# Altium schematic sheet MCU.SchDoc
size A4; CompanyName: TechOcean Sp. z o. o.; Address1: 02-639 Warszawa; Address2: Domaniewska 37A/119; Revision: 1.0; SheetNumber: 2; SheetTotal: 5
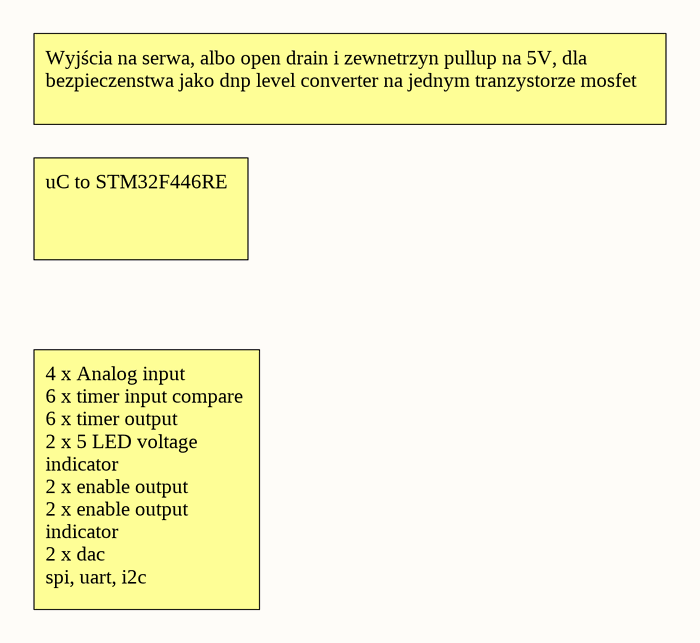
[diagram p0: MCU.SchDoc]

## Notes on the sheet
- Wyjścia na serwa, albo open drain i zewnetrzyn pullup na 5V, dla bezpieczenstwa jako dnp level converter na jednym tranzystorze mosfet
- uC to STM32F446RE
- 4 x Analog input            6 x timer input compare 6 x timer output             2 x 5 LED voltage indicator                        2 x enable output            2 x enable output indicator                         2 x dac                         spi, uart, i2c
- Project:
- Variant:
- File:
- Sheet:
- Revision:
- Total Sheet:
- Politechnika Warszawska
- Wydział Elektryczny
- Pl. Politechniki 1
- Author:
- Piotr Czapnik
- Modified:
- 00-661 Warszawa